# Altium schematic sheet Total.SchDoc
size 420 x 297 mm; SheetTotal: 1
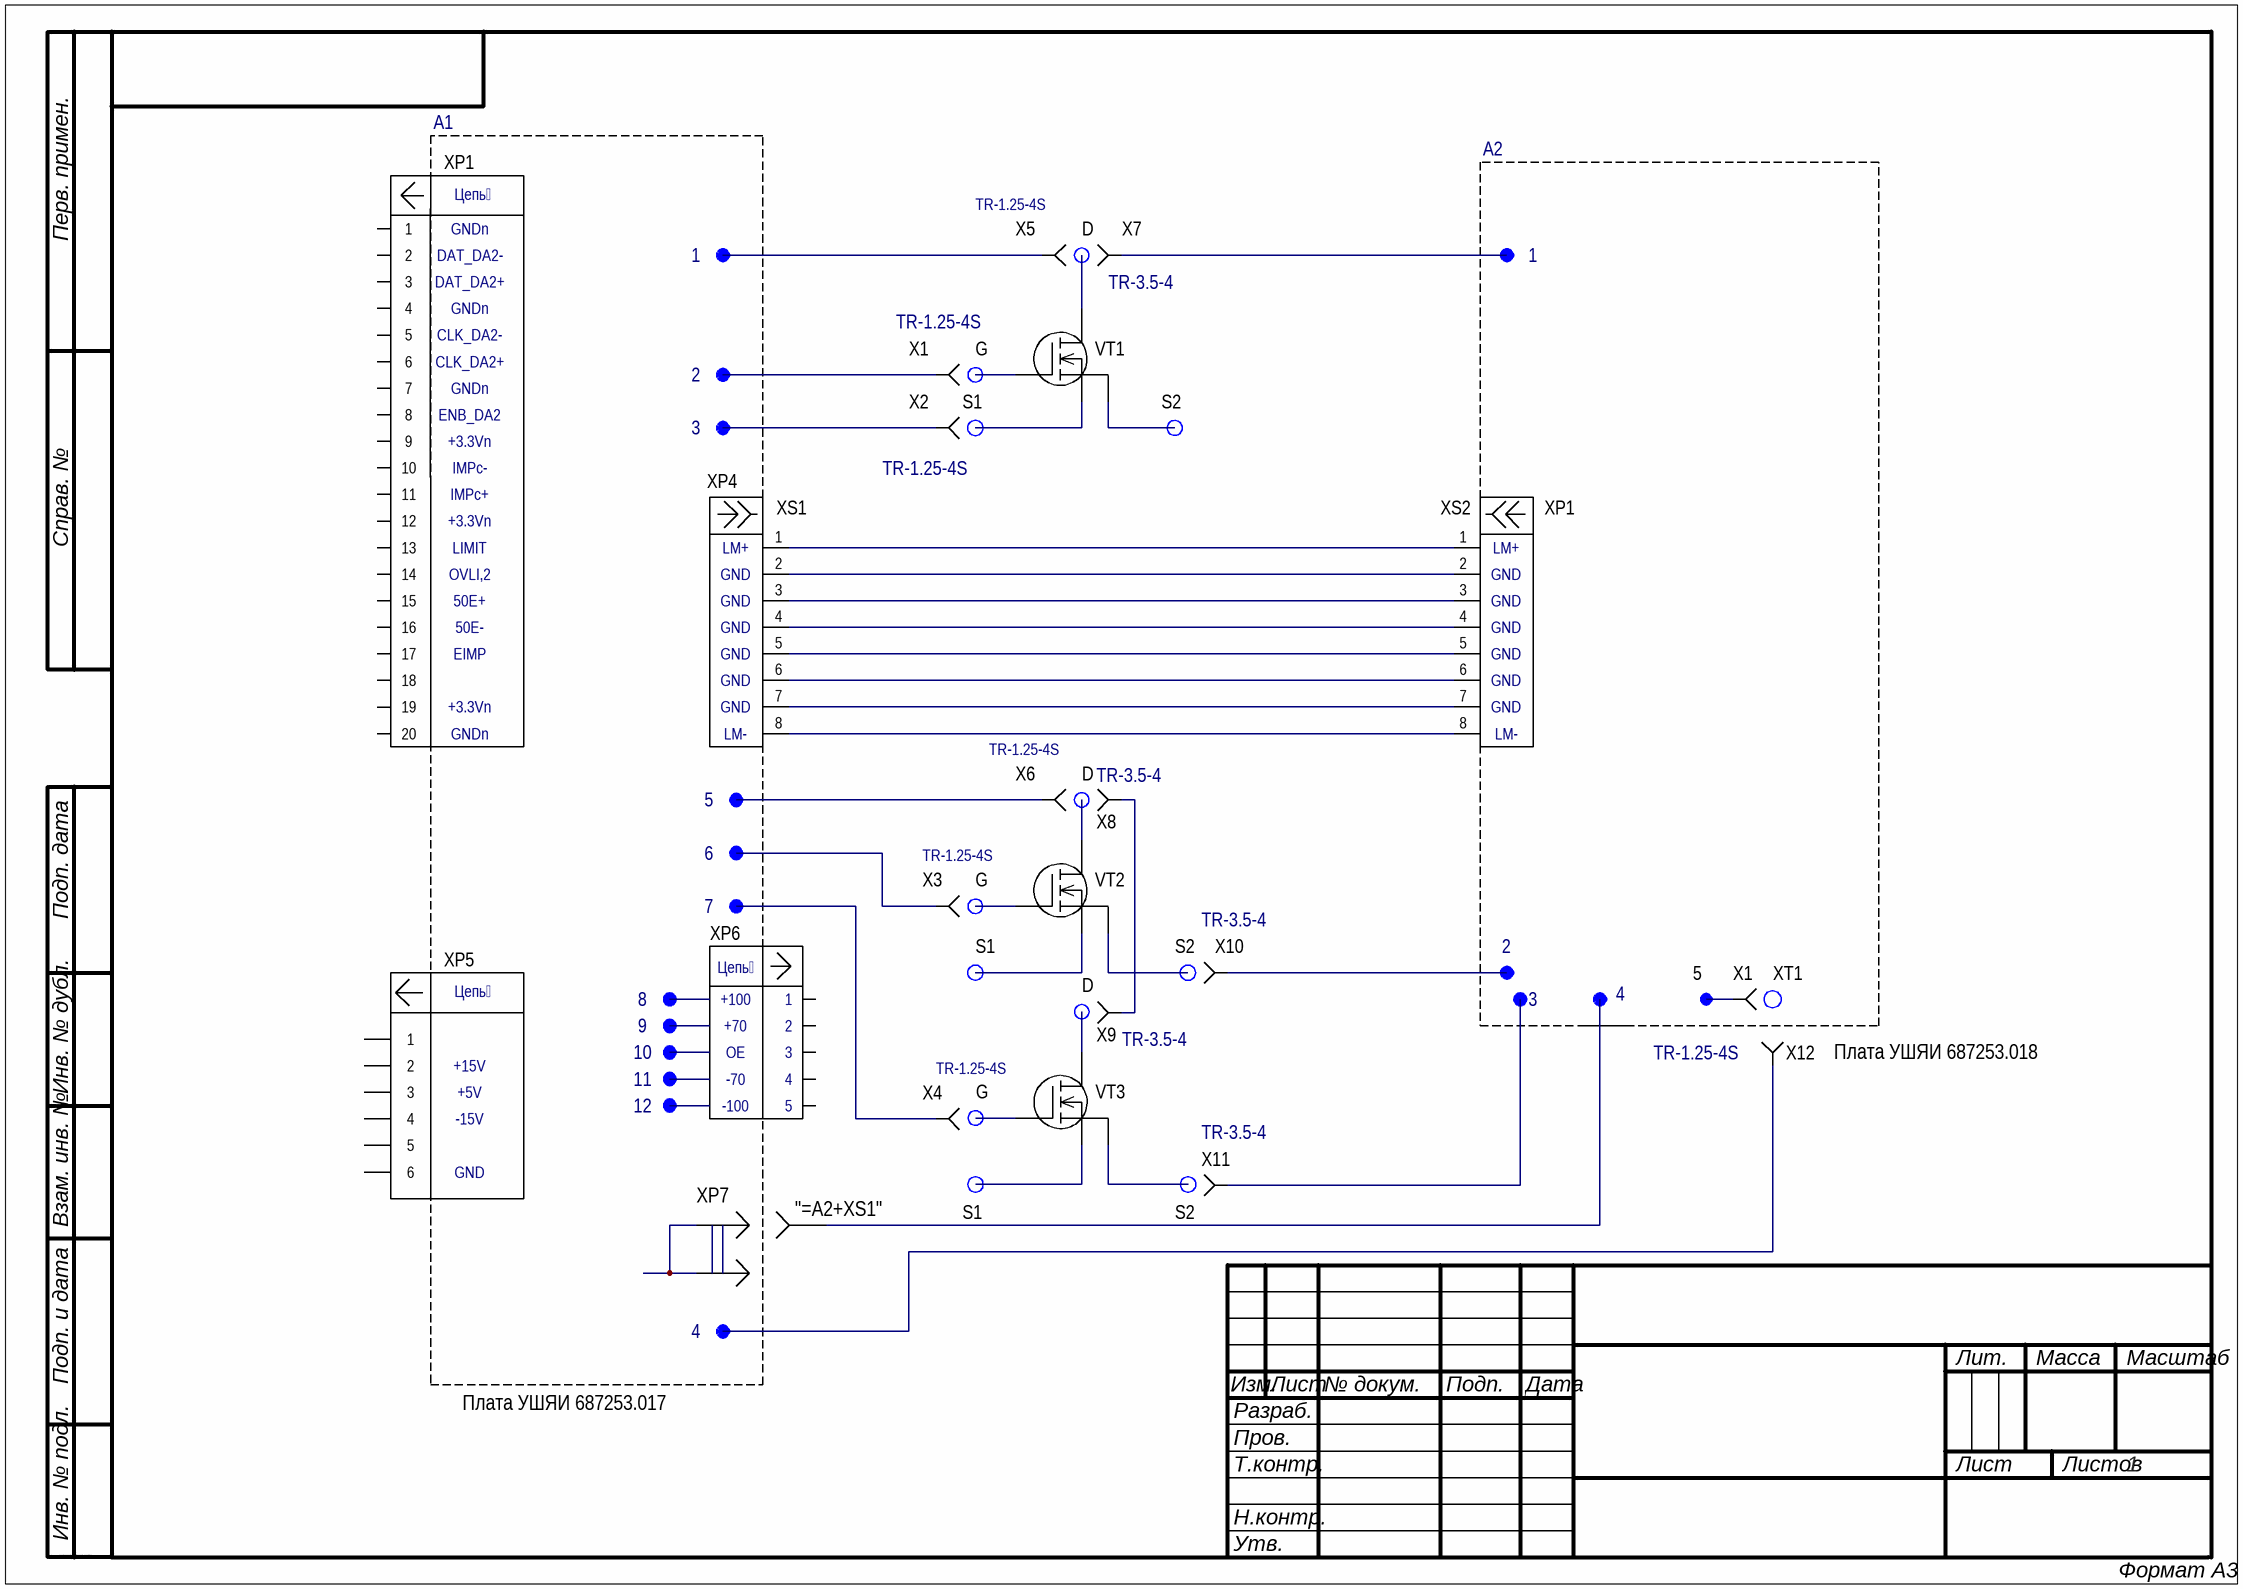
[diagram p0: Total.SchDoc]

## Parts
(Parts that share a designator on the sheet are numbered #1, #2 ... from top to bottom, then left to right.)
5  OTV  (value not drawn)
VT1  пе  [SOT-227B]  (value not drawn)
VT2  IXFN210N30P3  [SOT-227B]  (value not drawn)
VT3  IXFN210N30P3  [SOT-227B]  (value not drawn)
X1#1  TR-1.25-4S
X1#2  TR-3.5-4  (value not drawn)
X2  TR-1.25-4S
X3  TR-1.25-4S
X4  TR-1.25-4S
X5  TR-1.25-4S
X6  TR-1.25-4S
X7  TR-3.5-4
X8  TR-3.5-4
X9  TR-3.5-4
X10  TR-3.5-4
X11  TR-3.5-4
X12  TR-1.25-4S
XP1  BH2-20  (value not drawn)
XP5  280372-2  [280372-2]  (value not drawn)
XP6  MNL-350810-1  (value not drawn)
XS1  280361  (value not drawn)
XS2  280361  (value not drawn)
XT1  УШЯИ.685631.123  (value not drawn)

## Nets
NetXS1_1: XS1.1 XS2.1
NetXS1_2: XS1.2 XS2.2
NetXS1_3: XS1.3 XS2.3
NetXS1_4: XS1.4 XS2.4
NetXS1_5: XS1.5 XS2.5
NetXS1_6: XS1.6 XS2.6
NetXS1_7: XS1.7 XS2.7
NetXS1_8: XS1.8 XS2.8

Not connected (* = marked no-connect by the designer): 5 ?1; VT1 D G S; VT2 D G S; VT3 D G S; XP1 1 2 3 4 5 6 7 8 9 10 11 12 13 14 15 16 17 18 19 20; XP5 1 2 3 4 5 6; XP6 1 2 3 4 5

## Notes on the sheet
- A1
- A2
- (near XP1) 1
- (near XP1) 2
- (near XP1) DAT_DA2-
- GNDn
- 1
- D
- (near XP1) 3
- (near XP1) 4
- (near XP1) 5
- (near XP1) DAT_DA2+
- (near XP1) CLK_DA2-
- (near XP1) 6
- (near XP1) 7
- (near XP1) CLK_DA2+
- 2
- (near X1#1) G
- (near XP1) 8
- (near XP1) 9
- (near XP1) 10
- (near XP1) ENB_DA2
- IMPc-
- +3.3Vn
- 3
- S1
- S2
- (near XP1) 11
- (near XP1) 12
- IMPc+
- XP4
- XP1
- (near XP1) 13
- (near XP1) 14
- (near XP1) 15
- OVLI,2
- LIMIT
- 50E+
- (near XS1) LM+
- (near XS1) GND
- (near XS2) LM+
- (near XS2) GND
- (near XP1) 16
- (near XP1) 17
- EIMP
- 50E-
- (near XP1) 18
- (near XP1) 19
- (near XP1) 20
- (near XS1) LM-
- (near XS2) LM-
- 5
- 6
- 7
- (near X3) G
- 8
- (near XP6) +100
- (near XP6) 1
- (near X3) S1
- (near X9) D
- (near X10) S2
- 4
- +15V
- 9
- 10
- (near XP6) +70
- OE
- (near XP6) 2
- (near XP6) 3
- Плата УШЯИ 687253.018
- +5V
- -15V
- 11
- 12
- (near XP6) -70
- (near XP6) -100
- (near XP6) 4
- (near XP6) 5
- (near X4) G
- GND
- XP7
- "=A2+XS1"
- (near X11) S2
- Плата УШЯИ 687253.017
- Перв. примен.
- Справ. №
- Подп. дата
- Инв. № дубл.
- Взам. инв. №
- Подп. и дата
- Изм.
- Разраб.
- Лист
- № докум.
- Подп.
- Дата
- Лит.
- Масса
- Масштаб
- Пров.
- Т.контр.
- Листов
- Инв. № подл.
- Н.контр.
- Утв.
- ALTIUM GOSTBOM2.0 KEV
- Формат А3
- (in symbol 280372-2) Цепь
- (in symbol BH2-20) Цепь
- (in symbol MNL-350810-1) Цепь

## Library data of the parts
VT1 = IXFN210N30P3
X1#2 X7-X11 = TR-3.5-4: TR-3.5-4 клемма типа "O"
XP1 = BH2-20: IDC2-20MS DS1014 20 pin
XP5 = 280372-2: Connector